# Altium schematic sheet BMS_1_2026-08-27.schdoc
size 397 x 220 mm
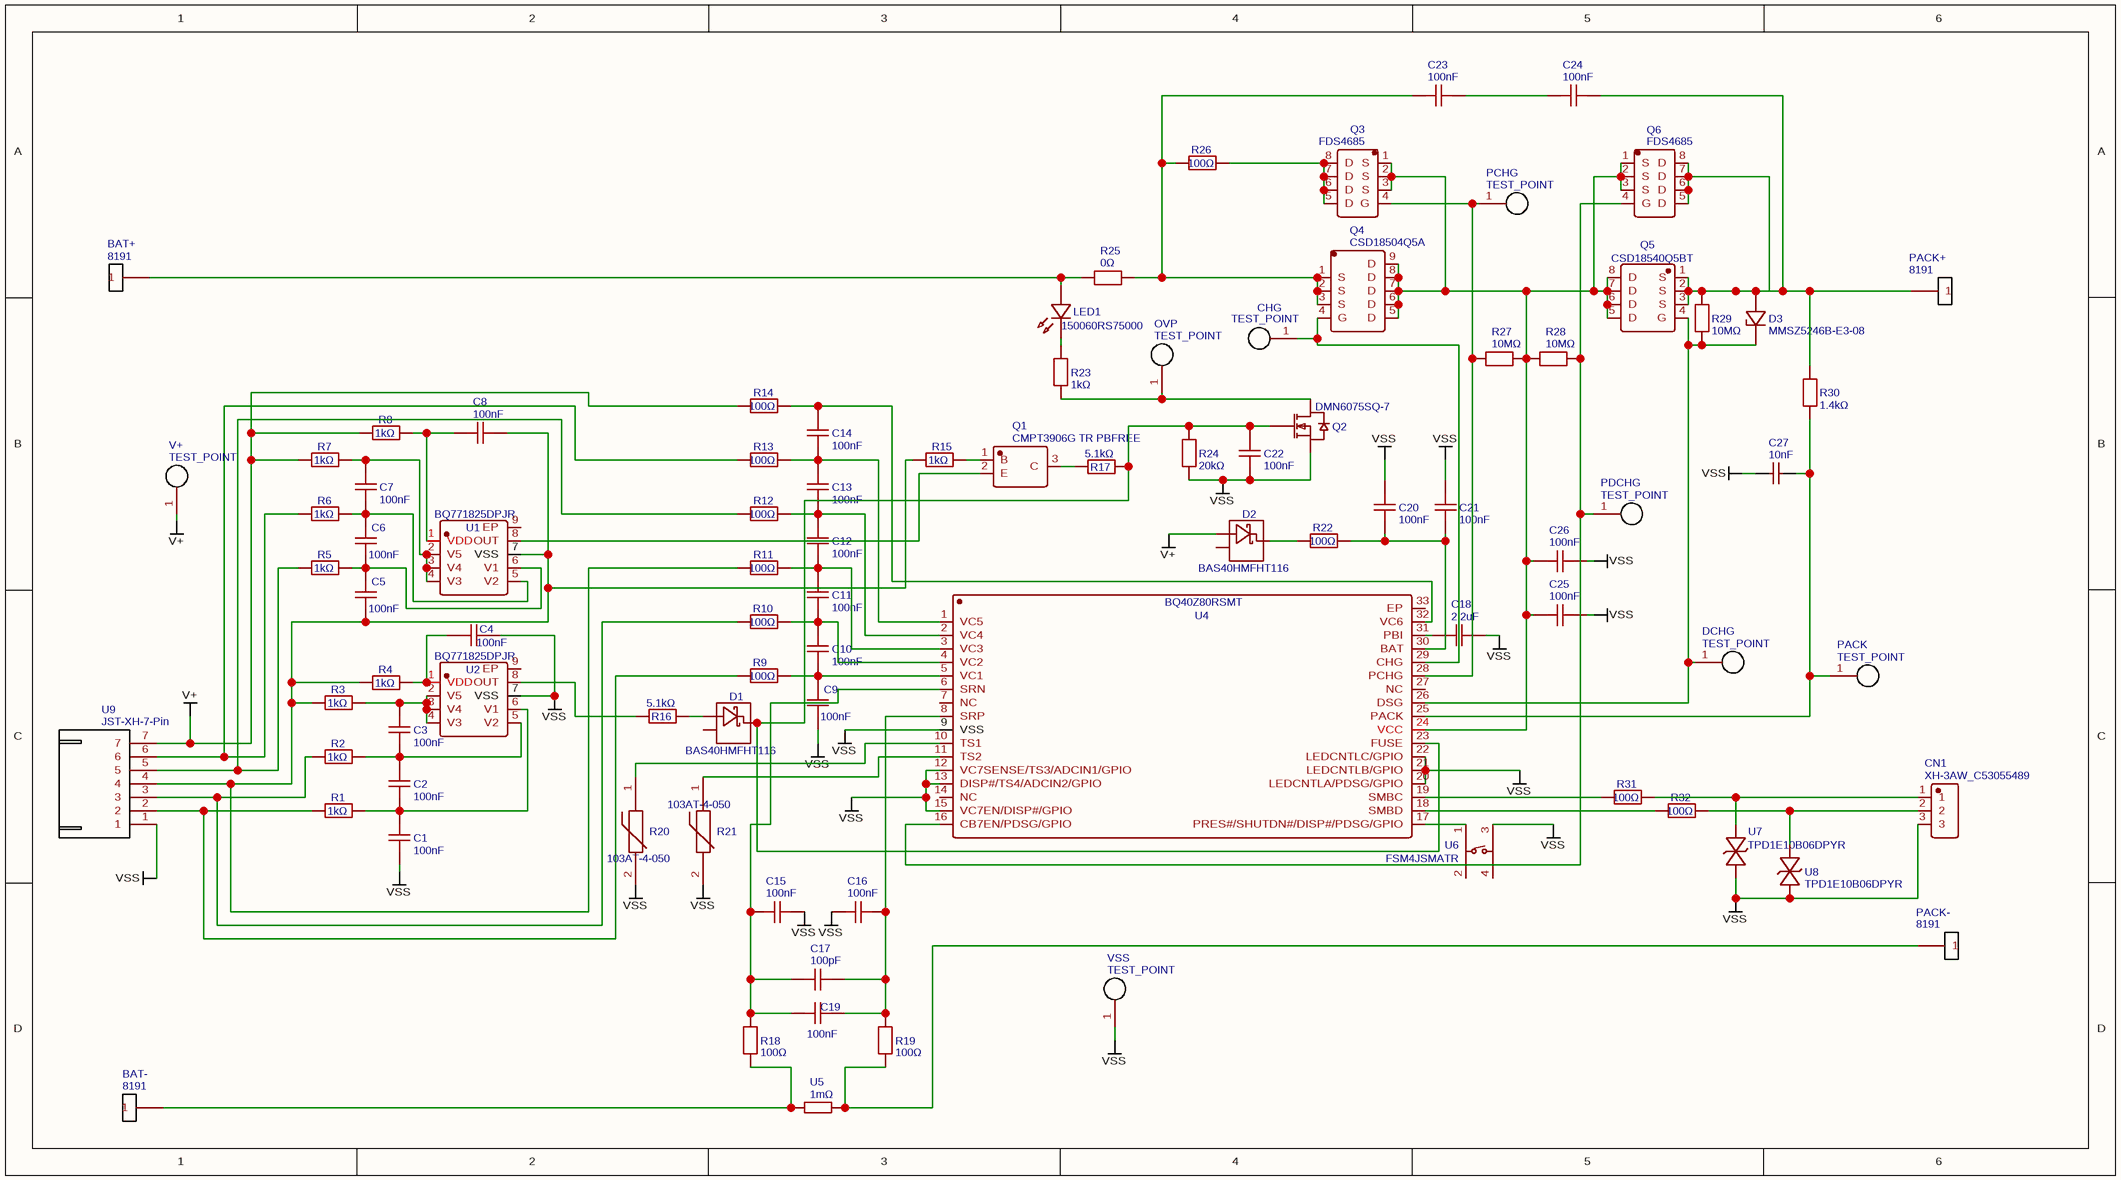
[diagram p0: BMS_1_2026-08-27.schdoc]

## Parts
BAT+  8191  [KEYSTONE_ELECTRONICS_8191_SCREW_TERMINAL]
BAT-  8191  [KEYSTONE_ELECTRONICS_8191_SCREW_TERMINAL]
C1  100nF  [C0603]
C2  100nF  [C0603]
C3  100nF  [C0603]
C4  100nF  [C0603]
C5  100nF  [C0603]
C6  100nF  [C0603]
C7  100nF  [C0603]
C8  100nF  [C0603]
C9  100nF  [C0603]
C10  100nF  [C0603]
C11  100nF  [C0603]
C12  100nF  [C0603]
C13  100nF  [C0603]
C14  100nF  [C0603]
C15  100nF  [C0603]
C16  100nF  [C0603]
C17  100pF  [C0603]
C18  2.2uF  [C0805]
C19  100nF  [C0603]
C20  100nF  [C0603]
C21  100nF  [C0603]
C22  100nF  [C0603]
C23  100nF  [C0603]
C24  100nF  [C0603]
C25  100nF  [C0603]
C26  100nF  [C0603]
C27  10nF  [C0603]
CHG  TEST_POINT  [TESTPOINT-TH_BD2.0-D1.0_TESTPOINT-TH_BD2.0-D1.0]
CN1  XH-3AW_C53055489  [CONN-TH_XH-3AW]
D1  BAS40HMFHT116  [SOT-23-3_L2.9-W1.3-P1.90-LS2.4-BR]
D2  BAS40HMFHT116  [SOT-23-3_L2.9-W1.3-P1.90-LS2.4-BR]
D3  MMSZ5246B-E3-08  [SOD-123_L2.7-W1.6-LS3.7-FD]
DCHG  TEST_POINT  [TESTPOINT-TH_BD2.0-D1.0_TESTPOINT-TH_BD2.0-D1.0]
LED1  150060RS75000  [LED0603-RD_RED]
OVP  TEST_POINT  [TESTPOINT-TH_BD2.0-D1.0_TESTPOINT-TH_BD2.0-D1.0]
PACK  TEST_POINT  [TESTPOINT-TH_BD2.0-D1.0_TESTPOINT-TH_BD2.0-D1.0]
PACK+  8191  [KEYSTONE_ELECTRONICS_8191_SCREW_TERMINAL]
PACK-  8191  [KEYSTONE_ELECTRONICS_8191_SCREW_TERMINAL]
PCHG  TEST_POINT  [TESTPOINT-TH_BD2.0-D1.0_TESTPOINT-TH_BD2.0-D1.0]
PDCHG  TEST_POINT  [TESTPOINT-TH_BD2.0-D1.0_TESTPOINT-TH_BD2.0-D1.0]
Q1  CMPT3906G TR PBFREE  [SOT-23-3_L2.9-W1.3-P1.90-LS2.4-TL]
Q2  DMN6075SQ-7  [SOT-23-3_L2.9-W1.3-P1.90-LS2.4-BR]
Q3  FDS4685  [SO-8_L4.9-W3.9-P1.27-LS5.9-BL]
Q4  CSD18504Q5A  [DFN-8_L5.8-W4.9-P1.27-LS6.0-BL-1]
Q5  CSD18540Q5BT  [PDFNWB-8L_L6.0-W5.0-P1.27-BL-EP]
Q6  FDS4685  [SO-8_L4.9-W3.9-P1.27-LS5.9-BL]
R1  1kΩ  [R0603]
R2  1kΩ  [R0603]
R3  1kΩ  [R0603]
R4  1kΩ  [R0603]
R5  1kΩ  [R0603]
R6  1kΩ  [R0603]
R7  1kΩ  [R0603]
R8  1kΩ  [R0603]
R9  100Ω  [R0603]
R10  100Ω  [R0603]
R11  100Ω  [R0603]
R12  100Ω  [R0603]
R13  100Ω  [R0603]
R14  100Ω  [R0603]
R15  1kΩ  [R0603]
R16  5.1kΩ  [R0603]
R17  5.1kΩ  [R0603]
R18  100Ω  [R0603]
R19  100Ω  [R0603]
R20  103AT-4-050  [RES-TH_L2.5-W2.5-P1.70-D0.3]
R21  103AT-4-050  [RES-TH_L2.5-W2.5-P1.70-D0.3]
R22  100Ω  [R0603]
R23  1kΩ  [R0603]
R24  20kΩ  [R0603]
R25  0Ω  [R1225]
R26  100Ω  [R0603]
R27  10MΩ  [R0603]
R28  10MΩ  [R0603]
R29  10MΩ  [R0603]
R30  1.4kΩ  [R0603]
R31  100Ω  [R0603]
R32  100Ω  [R0603]
U1  BQ771825DPJR  [WSON-8_L4.0-W3.0-P0.65-TL-EP]
U2  BQ771825DPJR  [WSON-8_L4.0-W3.0-P0.65-TL-EP]
U4  BQ40Z80RSMT  [VQFN-32_L4.0-W4.0-P0.40-TL-EP1.4]
U5  1mΩ  [R1210]
U6  FSM4JSMATR  [SW-SMD_4P-L6.0-W6.0-P4.50-LS10.0-1]
U7  TPD1E10B06DPYR  [X1SON-2_L1.0-W0.6-P0.65-BI-1]
U8  TPD1E10B06DPYR  [X1SON-2_L1.0-W0.6-P0.65-BI-1]
U9  JST-XH-7-Pin  [JST-XH-7-PIN]
V+  TEST_POINT  [TESTPOINT-TH_BD2.0-D1.0_TESTPOINT-TH_BD2.0-D1.0]
VSS  TEST_POINT  [TESTPOINT-TH_BD2.0-D1.0_TESTPOINT-TH_BD2.0-D1.0]

## Nets
V+: D2.1(A) R7.1 R8.1 R14.1 U9.7 V+.1(TEST)
VSS: C1.1 C4.1 C9.1 C15.2 C16.2 C18.2 C20.2 C21.2 C22.1 C25.1 C26.1 C27.1 CN1.3 Q2.2(S) R20.2 R21.2 R24.1 U2.7(VSS) U4.9(VSS) U4.12(VC7SENSE/TS3/ADCIN1/GPIO) U4.13(DISP#/TS4/ADCIN2/GPIO) U4.15(VC7EN/DISP#/GPIO) U4.20(LEDCNTLA/PDSG/GPIO) U4.21(LEDCNTLB/GPIO) U4.22(LEDCNTLC/GPIO) U6.3 U7.2 U8.2 U9.1 VSS.1(TEST)
NetBAT+_1: BAT+.1 LED1.2(A) R25.1
NetBAT-_1: BAT-.1 R18.2 U5.2
NetC1_2: C1.2 C2.1 R1.2 U2.6(V1)
NetC2_2: C2.2 C3.1 R2.2 U2.5(V2)
NetC3_2: C3.2 R3.2 U2.2(V5) U2.3(V4) U2.4(V3)
NetC4_2: C4.2 R4.2 U2.1(VDD)
NetC5_1: C5.1 C8.1 R3.1 R4.1 R11.1 R15.1 U1.7(VSS) U9.4
NetC5_2: C5.2 C6.1 R5.2 U1.6(V1)
NetC6_2: C6.2 C7.1 R6.2 U1.5(V2)
NetC7_2: C7.2 R7.2 U1.2(V5) U1.3(V4) U1.4(V3)
NetC8_2: C8.2 R8.2 U1.1(VDD)
NetC9_2: C9.2 C10.1 R9.2 U4.5(VC1)
NetC10_2: C10.2 C11.1 R10.2 U4.4(VC2)
NetC11_2: C11.2 C12.1 R11.2 U4.3(VC3)
NetC12_2: C12.2 C13.1 R12.2 U4.2(VC4)
NetC13_2: C13.2 C14.1 R13.2 U4.1(VC5)
NetC14_2: C14.2 R14.2 U4.32(VC6)
NetC15_1: C15.1 C17.1 C19.2 R18.1 U4.6(SRN)
NetC16_1: C16.1 C17.2 C19.1 R19.2 U4.8(SRP)
NetC18_1: C18.1 U4.31(PBI)
NetC20_1: C20.1 C21.1 R22.2 U4.30(BAT)
NetC22_2: C22.2 D1.3(K) Q2.1(G) R17.2 R24.2 U4.23(FUSE)
NetC23_1: C23.1 C24.2
NetC23_2: C23.2 Q4.1(S) Q4.2(S) Q4.3(S) R25.2 R26.1
NetC24_1: C24.1 D3.1(A) PACK+.1 Q5.1(S) Q5.2(S) Q5.3(S) Q6.5(D) Q6.6(D) Q6.7(D) Q6.8(D) R29.2 R30.2
NetC25_2: C25.2 C26.2 Q3.1(S) Q3.2(S) Q3.3(S) Q4.5(D) Q4.6(D) Q4.7(D) Q4.8(D) Q4.9(D) Q5.5(D) Q5.6(D) Q5.7(D) Q5.8(D) Q6.1(S) Q6.2(S) Q6.3(S) R27.2 R28.1 U4.24(VCC)
NetC27_2: C27.2 PACK.1(TEST) R30.1 U4.25(PACK)
NetCHG_1: CHG.1(TEST) Q4.4(G) U4.29(CHG)
NetCN1_1: CN1.1 R31.2 U7.1
NetCN1_2: CN1.2 R32.2 U8.1
NetD1_1: D1.1(A) R16.2
NetD2_3: D2.3(K) R22.1
NetD3_2: D3.2(C) DCHG.1(TEST) Q5.4(G) R29.1 U4.26(DSG)
NetLED1_1: LED1.1(K) R23.2
NetOVP_1: OVP.1(TEST) Q2.3(D) R23.1
NetPACK-_1: PACK-.1 R19.1 U5.1
NetPCHG_1: PCHG.1(TEST) Q3.4(G) R27.1 U4.28(PCHG)
NetPDCHG_1: PDCHG.1(TEST) Q6.4(G) R28.2 U4.16(CB7EN/PDSG/GPIO)
NetQ1_1: Q1.1(B) R15.2
NetQ1_2: Q1.2(E) U1.8(OUT)
NetQ1_3: Q1.3(C) R17.1
NetQ3_5: Q3.5(D) Q3.6(D) Q3.7(D) Q3.8(D) R26.2
NetR1_1: R1.1 R9.1 U9.2
NetR2_1: R2.1 R10.1 U9.3
NetR5_1: R5.1 R12.1 U9.5
NetR6_1: R6.1 R13.1 U9.6
NetR16_1: R16.1 U2.8(OUT)
NetR20_1: R20.1 U4.10(TS1)
NetR21_1: R21.1 U4.11(TS2)
NetR31_1: R31.1 U4.19(SMBC)
NetR32_1: R32.1 U4.18(SMBD)
NetU4_17: U4.17(PRES#/SHUTDN#/DISP#/PDSG/GPIO) U6.1

Not connected (* = marked no-connect by the designer): D1 2; D2 2; U1 9(EP); U2 9(EP); U4 7(NC) 14(NC) 27(NC) 33(EP); U6 2 4

## Library data of the parts
BAT+ BAT- PACK+ PACK- = 8191: Contributor: carlo1300; Manufacturer Part: 8191; Supplier Part: 36-8191-ND; Supplier: Digi-Key; link: http://www.keyelco.com/product-pdf.cfm?p=1517; spicePre: T; spiceSymbolName: 8191
C1-C16 C19-C26 = 100nF: Manufacturer: muRata(村田); Manufacturer Part: GRM188R71H104KA93D; nameAlias: Value; Supplier: LCSC; Supplier Part: C77055; JLCPCB Part Class: Extended Part; spicePre: C; spiceSymbolName: GRM188R71H104KA93D
C17 = 100pF: Manufacturer: KEMET(基美); Manufacturer Part: C0603C101J5GAC3121; nameAlias: Value; Contributor: LCSC; Supplier: LCSC; Supplier Part: C599626; JLCPCB Part Class: Extended Part; spicePre: C; spiceSymbolName: C0603C101J5GAC3121
C18 = 2.2uF: Manufacturer: muRata(村田); Manufacturer Part: GRM21BR71E225KA73L; nameAlias: Value; Contributor: LCSC; Supplier: LCSC; Supplier Part: C469542; JLCPCB Part Class: Extended Part; spicePre: C; spiceSymbolName: GRM21BR71E225KA73L
C27 = 10nF: Manufacturer Part: GRM188R71H103KA01D; Manufacturer: muRata(村田); nameAlias: Value; Supplier: LCSC; Supplier Part: C77053; JLCPCB Part Class: Extended Part; spicePre: C; spiceSymbolName: GRM188R71H103KA01D
CHG DCHG OVP PACK PCHG PDCHG V+ VSS = TEST_POINT: Contributor: erandi; spicePre: U; spiceSymbolName: TEST_POINT
CN1 = XH-3AW_C53055489: Manufacturer: LXWCONN(连兴旺电子); Manufacturer Part: XH-3AW; Contributor: lcsc; Supplier: LCSC; Supplier Part: C53055489; JLCPCB Part Class: Extended Part; spicePre: C; spiceSymbolName: XH-3AW_C53055489
D1 D2 = BAS40HMFHT116: Manufacturer: ROHM(罗姆); Contributor: LCSC; Supplier: LCSC; Supplier Part: C509812; Manufacturer Part: BAS40HMFHT116; JLCPCB Part Class: Extended Part; spicePre: D; spiceSymbolName: BAS40HMFHT116
D3 = MMSZ5246B-E3-08: Manufacturer: VISHAY(威世); Contributor: lcsc; Supplier: LCSC; Supplier Part: C3735949; Manufacturer Part: MMSZ5246B-E3-08; JLCPCB Part Class: Extended Part; spicePre: D; spiceSymbolName: MMSZ5246B-E3-08
LED1 = 150060RS75000: Manufacturer: Wurth(伍尔特); Contributor: lcsc; Supplier: LCSC; Supplier Part: C3030991; Manufacturer Part: 150060RS75000; JLCPCB Part Class: Extended Part; spicePre: L; spiceSymbolName: 150060RS75000
Q1 = CMPT3906G TR PBFREE: Manufacturer: Central(中环); Contributor: lcsc; Supplier: LCSC; Supplier Part: C7230175; Manufacturer Part: CMPT3906G TR PBFREE; JLCPCB Part Class: Extended Part; spicePre: Q; spiceSymbolName: CMPT3906G TR PBFREE
Q2 = DMN6075SQ-7: Manufacturer: DIODES(美台); Contributor: lcsc; Supplier: LCSC; Supplier Part: C6601826; Manufacturer Part: DMN6075SQ-7; JLCPCB Part Class: Extended Part; spicePre: Q; spiceSymbolName: DMN6075SQ-7
Q3 Q6 = FDS4685: Manufacturer: onsemi(安森美); Contributor: LCSC; Supplier: LCSC; Supplier Part: C336026; Manufacturer Part: FDS4685; JLCPCB Part Class: Extended Part; spicePre: Q; spiceSymbolName: FDS4685
Q4 = CSD18504Q5A: Manufacturer: TI(德州仪器); Contributor: LCSC; Supplier: LCSC; Supplier Part: C78118; Manufacturer Part: CSD18504Q5A; JLCPCB Part Class: Extended Part; spicePre: Q; spiceSymbolName: CSD18504Q5A
Q5 = CSD18540Q5BT: Manufacturer: TI(德州仪器); Contributor: LCSC; Supplier: LCSC; Supplier Part: C2863985; Manufacturer Part: CSD18540Q5BT; JLCPCB Part Class: Extended Part; spicePre: Q; spiceSymbolName: CSD18540Q5BT
R1-R8 R15 R23 = 1kΩ: Manufacturer: VISHAY(威世); Manufacturer Part: CRCW06031K00JNEA; Contributor: LCSC; nameAlias: Value; Supplier: LCSC; Supplier Part: C844748; JLCPCB Part Class: Extended Part; spicePre: R; spiceSymbolName: CRCW06031K00JNEA
R9-R14 R18 R19 R22 R26 R31 R32 = 100Ω: Manufacturer: VISHAY(威世); Manufacturer Part: CRCW0603100RJNEA; Contributor: LCSC; nameAlias: Value; Supplier: LCSC; Supplier Part: C844726; JLCPCB Part Class: Extended Part; spicePre: R; spiceSymbolName: CRCW0603100RJNEA
R16 R17 = 5.1kΩ: Manufacturer: VISHAY(威世); Manufacturer Part: CRCW06035K10JNEA; Contributor: LCSC; nameAlias: Value; Supplier: LCSC; Supplier Part: C844580; JLCPCB Part Class: Extended Part; spicePre: R; spiceSymbolName: CRCW06035K10JNEA
R20 R21 = 103AT-4-050: Manufacturer: semitec(石冢); Contributor: LCSC; Supplier: LCSC; Supplier Part: C497233; Manufacturer Part: 103AT-4-050; JLCPCB Part Class: Extended Part; spicePre: R; spiceSymbolName: 103AT-4-050
R24 = 20kΩ: Manufacturer: VISHAY(威世); Manufacturer Part: CRCW060320K0JNEA; Contributor: LCSC; nameAlias: Value; Supplier: LCSC; Supplier Part: C844341; JLCPCB Part Class: Extended Part; spicePre: R; spiceSymbolName: CRCW060320K0JNEA
R25 = 0Ω: Manufacturer: VISHAY(威世); Manufacturer Part: RCL12250000Z0EG; nameAlias: Value; Contributor: lcsc; Supplier: LCSC; Supplier Part: C2075819; JLCPCB Part Class: Extended Part; spicePre: R; spiceSymbolName: RCL12250000Z0EG
R27-R29 = 10MΩ: Manufacturer: VISHAY(威世); Manufacturer Part: CRCW060310M0JNEA; nameAlias: Value; Contributor: lcsc; Supplier: LCSC; Supplier Part: C2090725; JLCPCB Part Class: Extended Part; spicePre: R; spiceSymbolName: CRCW060310M0JNEA
R30 = 1.4kΩ: Manufacturer: VISHAY(威世); Manufacturer Part: CRCW06031K40FKEA; Contributor: LCSC; nameAlias: Value; Supplier: LCSC; Supplier Part: C844138; JLCPCB Part Class: Extended Part; spicePre: R; spiceSymbolName: CRCW06031K40FKEA
U1 U2 = BQ771825DPJR: Manufacturer: TI(德州仪器); Contributor: lcsc; Supplier: LCSC; Supplier Part: C5219182; Manufacturer Part: BQ771825DPJR; JLCPCB Part Class: Extended Part; spicePre: U; spiceSymbolName: BQ771825DPJR
U4 = BQ40Z80RSMT: Manufacturer: TI(德州仪器); Contributor: lcsc; Supplier: LCSC; Supplier Part: C528626; Manufacturer Part: BQ40Z80RSMT; JLCPCB Part Class: Extended Part; spicePre: U; spiceSymbolName: BQ40Z80RSMT
U5 = 1mΩ: Manufacturer: ROHM(罗姆); Manufacturer Part: PMR25HZPFV1L00; Contributor: LCSC; nameAlias: Value; Supplier: LCSC; Supplier Part: C509735; JLCPCB Part Class: Extended Part; spicePre: U; spiceSymbolName: PMR25HZPFV1L00
U6 = FSM4JSMATR: Manufacturer: TE Connectivity(泰科电子); Contributor: lcsc; Supplier: LCSC; Supplier Part: C2680629; Manufacturer Part: FSM4JSMATR; JLCPCB Part Class: Extended Part; spicePre: U; spiceSymbolName: FSM4JSMATR
U7 U8 = TPD1E10B06DPYR: Manufacturer: TI(德州仪器); Contributor: LCSC; Supplier: LCSC; Manufacturer Part: TPD1E10B06DPYR; Supplier Part: C48260; JLCPCB Part Class: Extended Part; spicePre: U; spiceSymbolName: TPD1E10B06DPYR
U9 = JST-XH-7-Pin: Contributor: loyboy; spicePre: U; spiceSymbolName: JST-XH-7-Pin